# EAGLE design emergency (EAGLE 9.4.2)

## Sheet 1 of 3
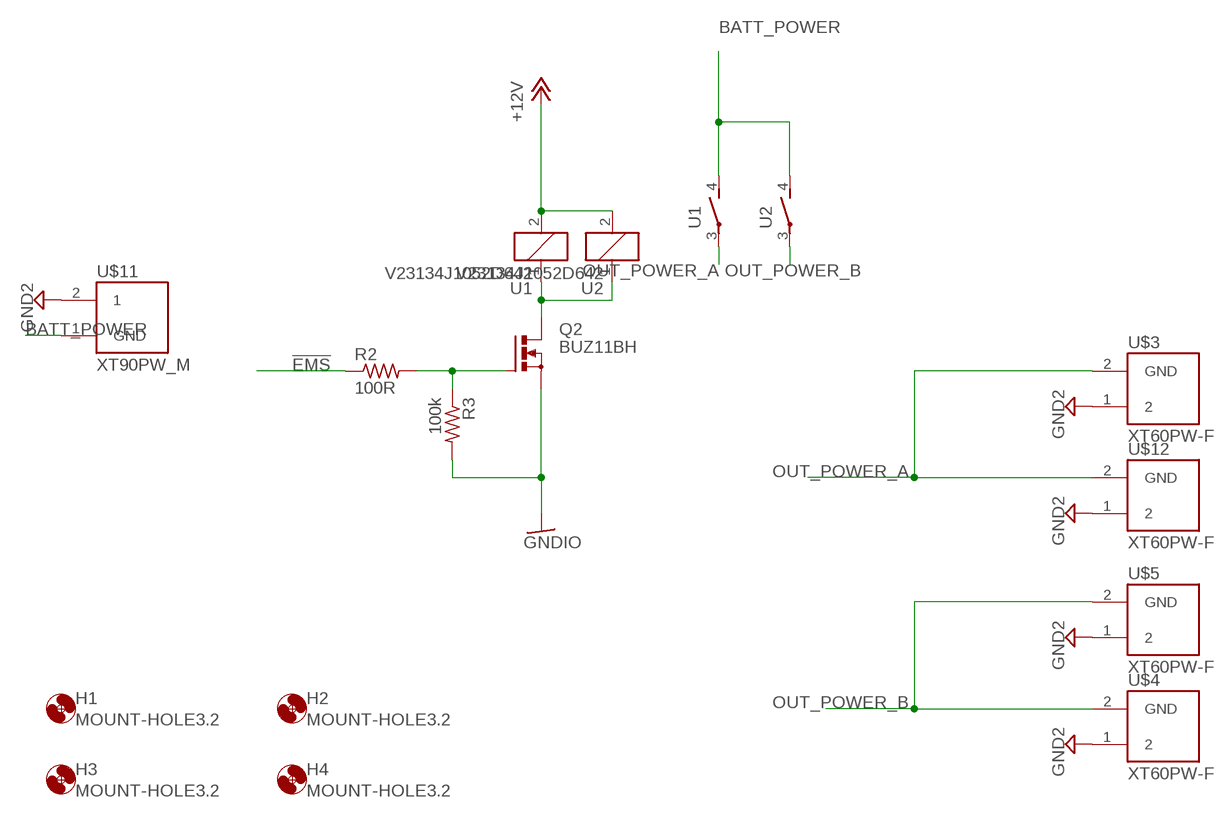
[diagram p0: schematic, sheet 1]

### Parts
H1  MOUNT-HOLE3.2  [3,2]
H2  MOUNT-HOLE3.2  [3,2]
H3  MOUNT-HOLE3.2  [3,2]
H4  MOUNT-HOLE3.2  [3,2]
Q2  BUZ11BH  [TO220BH]
R2  100R  R-US_R0603  [R0603]
R3  100k  R-US_R0603  [R0603]
U1  V23134J1052D642  [V23134J1052D642]
U2  V23134J1052D642  [V23134J1052D642]
U$3  XT60PW-F  [AMASS_XT60PW-F]
U$4  XT60PW-F  [AMASS_XT60PW-F]
U$5  XT60PW-F  [AMASS_XT60PW-F]
U$11  XT90PW_M  [AMASS_XT90PW_M]
U$12  XT60PW-F  [AMASS_XT60PW-F]

### Nets
!EMS: R2.1 ; also sheet 2
+12V: U1.2 U2.2 ; also sheet 2,3
BATT_POWER: U1.4(B:S) U2.4(B:S) U$11.1(GND)
GND2: U$3.1 U$4.1 U$5.1 U$11.2 U$12.1
GNDIO: Q2.S R3.2 ; also sheet 2,3
N$6: Q2.D U1.1 U2.1
N$7: Q2.G R2.2 R3.1
OUT_POWER_A: U1.3(B:P) U$3.2(GND) U$12.2(GND)
OUT_POWER_B: U2.3(B:P) U$4.2(GND) U$5.2(GND)

## Sheet 2 of 3
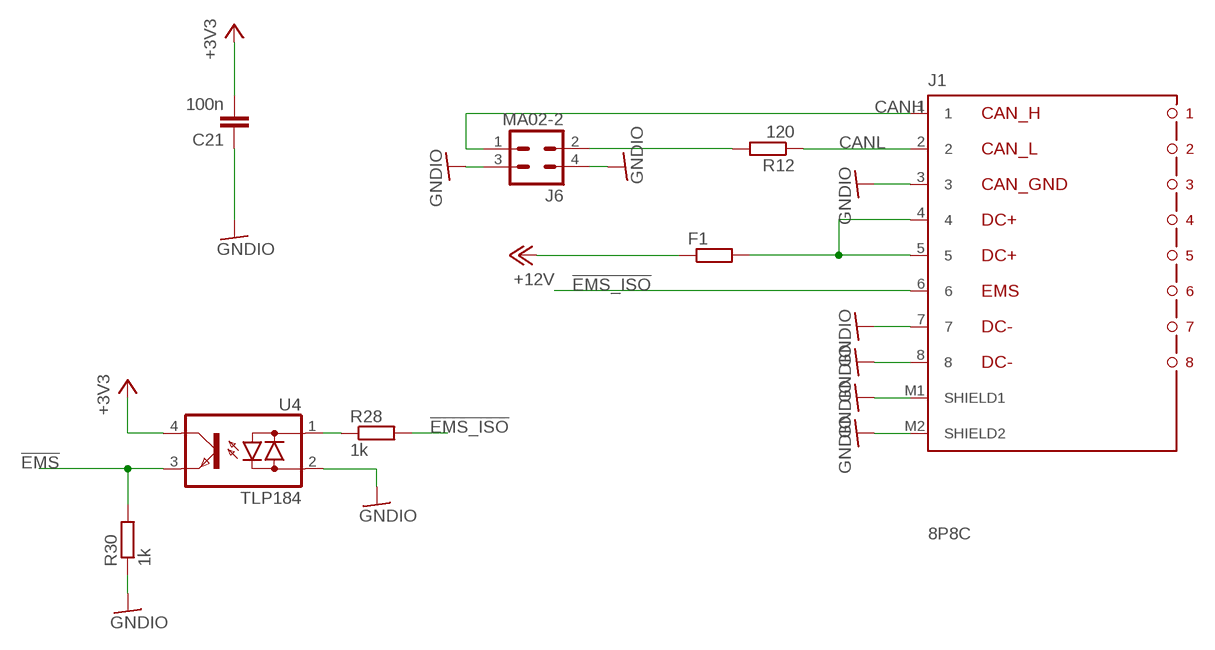
[diagram p1: schematic, sheet 2]

### Parts
C21  100n  C-EUC0603  [C0603]
F1  R-EU_R1206  [R1206]
J1  8P8C  [8P8C]
J6  MA02-2  [MA02-2W]
R12  120  R-EU_R0603  [R0603]
R28  1k  R-EU_R0603  [R0603]
R30  1k  R-EU_R0603  [R0603]
U4  TLP184  [11-4M1S]

### Nets
!EMS: R30.2 U4.3(E) ; also sheet 1
!EMS_ISO: J1.6 R28.2
+3V3: C21.2 U4.4(C) ; also sheet 3
+12V: F1.1 ; also sheet 1,3
CANH: J1.1 J6.1
CANL: J1.2 R12.1
GNDIO: C21.1 J1.3 J1.7 J1.8 J1.M1(SHIELD1) J1.M2(SHIELD2) J6.3 J6.4 R30.1 U4.2(AC2) ; also sheet 1,3
N$8: F1.2 J1.4 J1.5
N$9: J6.2 R12.2
N$30: R28.1 U4.1(AC1)

## Sheet 3 of 3
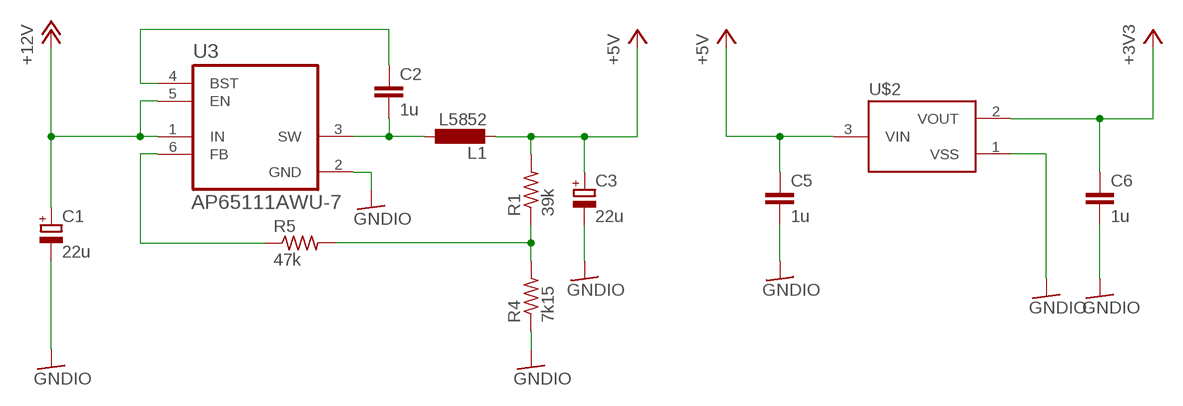
[diagram p2: schematic, sheet 3]

### Parts
C1  22u  CPOL-EUE2-5  [E2-5]
C2  1u  C-EUC0603  [C0603]
C3  22u  CPOL-EUE2-5  [E2-5]
C5  1u  C-EUC0603  [C0603]
C6  1u  C-EUC0603  [C0603]
L1  L5852  [L5852]
R1  39k  R-US_R0603  [R0603]
R4  7k15  R-US_R0603  [R0603]
R5  47k  R-US_R0603  [R0603]
U3  AP65111AWU-7  [SOT95P280X100-6N]
U$2  AP2120  [SOT95P240X110-3]

### Nets
+3V3: C6.1 U$2.2(VOUT) ; also sheet 2
+5V: C3.+ C5.1 L1.P$2 R1.2 U$2.3(VIN)
+12V: C1.+ U3.1(IN) U3.5(EN) ; also sheet 1,2
GNDIO: C1.- C3.- C5.2 C6.2 R4.1 U3.2(GND) U$2.1(VSS) ; also sheet 1,2
N$1: C2.2 L1.P$1 U3.3(SW)
N$2: C2.1 U3.4(BST)
N$3: R1.1 R4.2 R5.2
N$5: R5.1 U3.6(FB)

## Library data of the parts
C1 C3 = rcl:CPOL-EU: POLARIZED CAPACITOR, European symbol; SPICEPREFIX: C
C2 C5 C6 = rcl:C-EU: CAPACITOR, European symbol; SPICEPREFIX: C
C21 = rcl:C-EU: CAPACITOR, European symbol
F1 R12 R28 R30 = rcl:R-EU_: RESISTOR, European symbol; SPICEPREFIX: R
H1-H4 = holes:MOUNT-HOLE: MOUNTING HOLE with drill center marker
J1 = con-rj45:8P8C
J6 = con-headers:MA02-2
L1 = l_ysk:L5852
Q2 = transistor-power:BUZ11: N-CHANNEL MOS FET
R1-R5 = rcl:R-US_: RESISTOR, American symbol; SPICEPREFIX: R
U1 U2 = relay:V23134J1052D642
U3 = AP65111AWU-7:AP65111AWU-7: None; DESCRIPTION: Dcdc Conv Hv Buck Tsot26 t&r 3k; DIGI-KEY_PART_NUMBER: AP65111AWU-7DICT-ND; DIGI-KEY_PURCHASE_URL: https://www.digikey.jp/product-detail/en/diodes-incorporated/AP65111AWU-7/AP65111AWU-7DICT-ND/7652826?utm_source=snapeda&utm_medium=aggregator&utm_campaign=symbol; MF: Diodes Inc.; MP: AP65111AWU-7; PACKAGE: TSOT-23-6 Diodes Inc.
U4 = md201x:TLP184
U$2 = torex:AP2120
U$3-U$5 U$12 = XT60_Connecotr:XT60PW-F; AVAILABILITY: Unavailable; MF: AMASS; MP: XT60PW-M; PACKAGE: Package Analog Devices; PRICE: None
U$11 = XT60_Connecotr:XT90PW_M

## Board
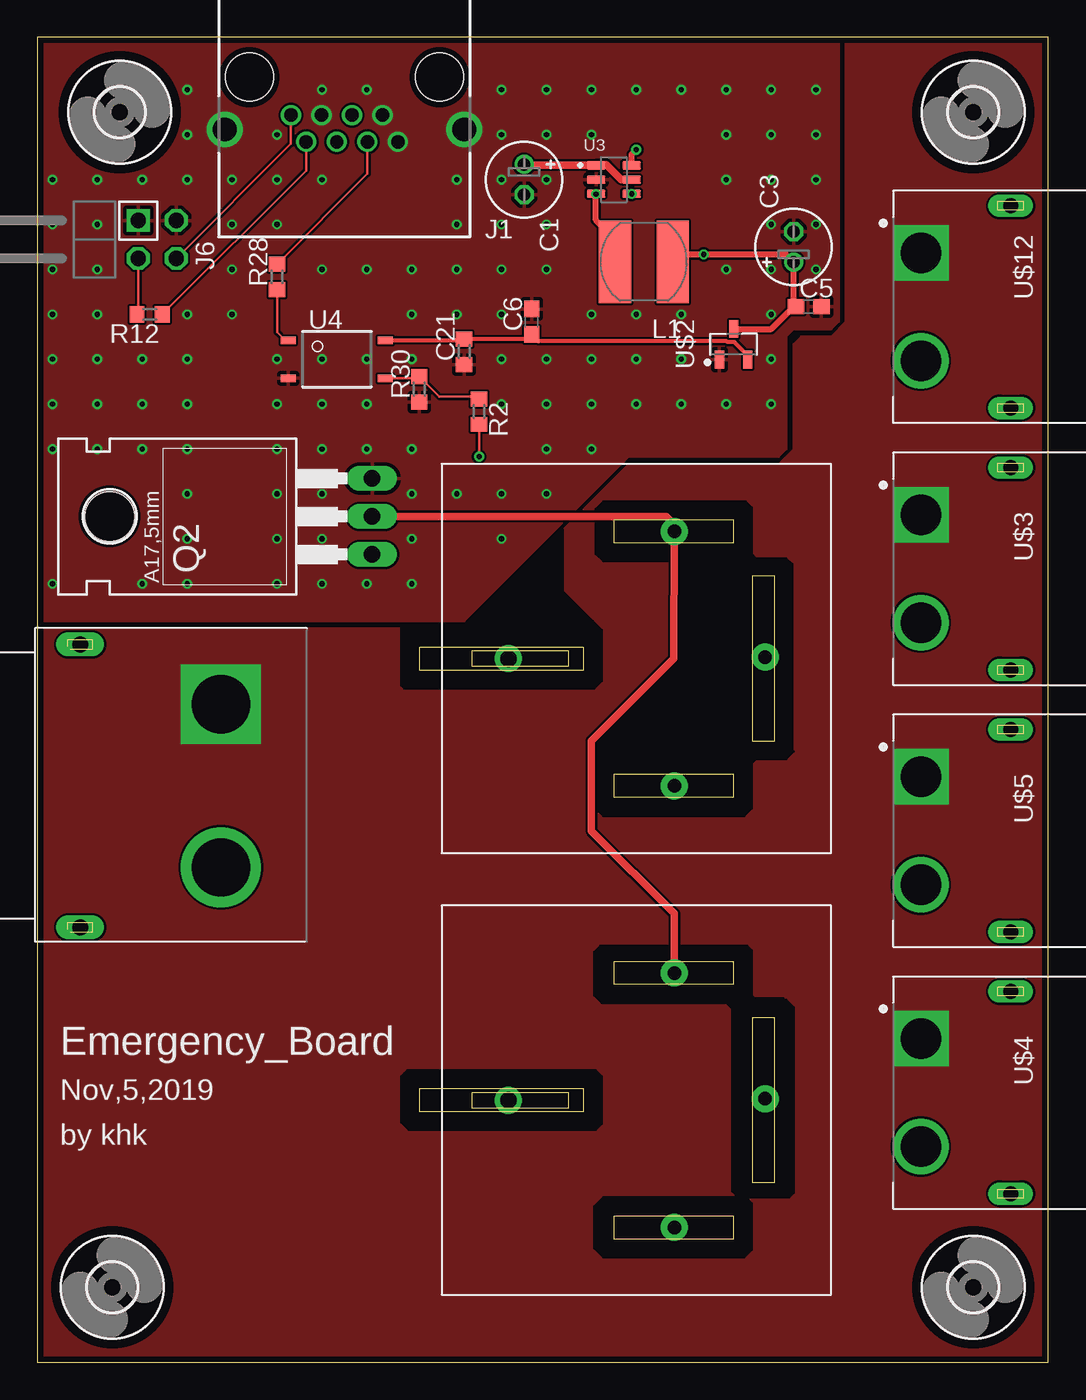
[diagram p3: board, top side]
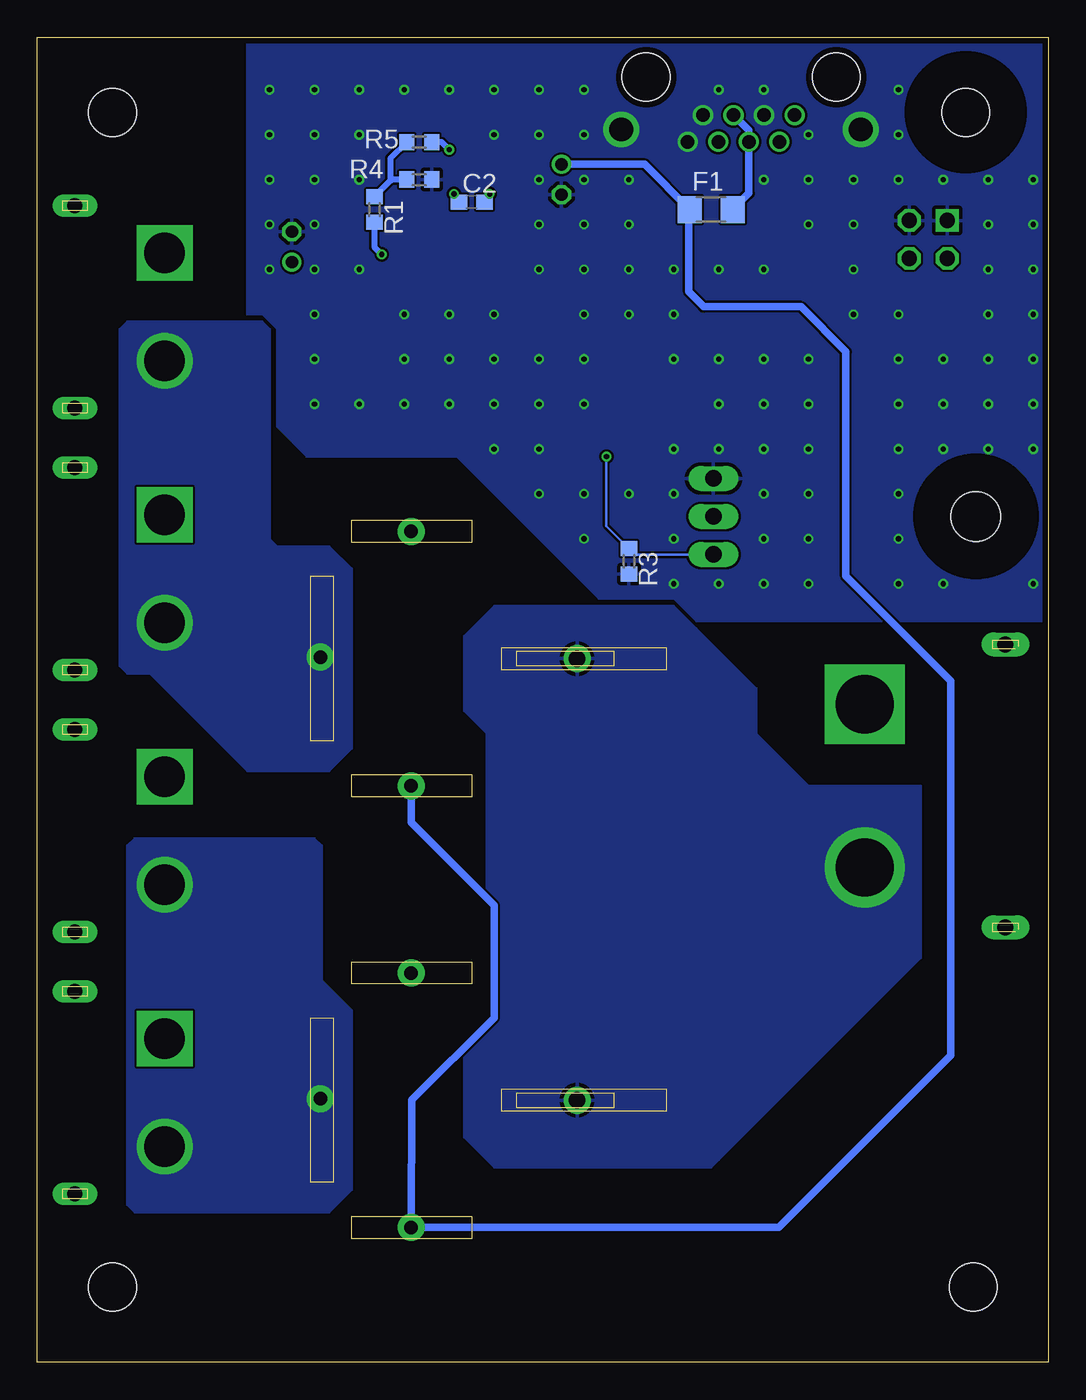
[diagram p4: board, bottom side, seen from below]

Size 67.5 x 88.5 mm. Coordinates in mm from the lower left corner, seen from the top.
Outline: 0,0 67.5,0 67.5,88.5 0,88.5 0,0
Copper layers (1*16): Top 0.035mm / dielectric 1.5mm / Bottom 0.035mm
Design rules "seeed_2layers": minimum track width 6mil, minimum drill 0.2mm, track to track 6mil, track to pad 6mil, pad to pad 6mil, via to via 6mil, smd to smd 0mil, copper to edge 0.4mm, drill to drill 12mil, minimum pad ring 0.15mm, minimum via ring 0.15mm, stop-mask expansion 4mil, vias tented up to drill 50mil, thermal gap 10mil

### Footprints (pad centres in the part's own frame; a part is rotated, then mirrored left to right if it is on the bottom)
E2-5 = drill 0.813 pad 1.27: + -1.016,0 | drill 0.813 pad 1.27 octagon: - 1.016,0
C0603 = smd 1.1 x 1: 1 -0.85,0; 2 0.85,0
C0603' = smd 1 x 1.1: 1 -0.85,0; 2 0.85,0
R1206 = smd 1.6 x 1.803: 1 -1.422,0; 2 1.422,0
3,2 = hole 3.2: 0,0
8P8C = drill 0.9 pad 1.3: 1 3.57,-3.81; 2 2.55,-2.03; 3 1.53,-3.81; 4 0.51,-2.03; 5 -0.51,-3.81; 6 -1.53,-2.03; 7 -2.55,-3.81; 8 -3.57,-2.03 | drill 1.6 pad 2.184: M1 -8,-2.85; M2 8,-2.85 | hole 3.2: 6.35,-6.35; -6.35,-6.35
MA02-2W = drill 1.016 octagon: 1 -1.27,-1.27; 2 -1.27,1.27; 3 1.27,-1.27 | drill 1.016 square: 4 1.27,1.27
L5852 = smd 2.15 x 5.5: P$1 1.925,0; P$2 -1.925,0
TO220BH = drill 1.118 long: D 0,-6.35; G -2.54,-6.35; S 2.54,-6.35 | hole 3.302: 0,11.176
R0603 = smd 1 x 1.1: 1 -0.85,0; 2 0.85,0
V23134J1052D642 = drill 0.9 pad 1.803: 1 -8.5,2.54; 2 8.5,2.54; 3 -0.1,8.6 | drill 1.092 pad 1.803: 4 0,-8.54
SOT95P280X100-6N = smd 1.24 x 0.55: 1 -1.185,0.95; 2 -1.185,0; 3 -1.185,-0.95; 4 1.185,-0.95; 5 1.185,0; 6 1.185,0.95
11-4M1S = smd 1 x 0.5: 1 -3.24,1.27; 2 -3.24,-1.27; 3 3.24,-1.27; 4 3.24,1.27
SOT95P240X110-3 = smd 1.18 x 0.609: 1 -1.024,0.95; 2 -1.024,-0.95; 3 1.024,0
AMASS_XT60PW-F = drill 2.7 square: 1 -3.6,-6 | drill 2.7: 2 3.6,-6 | drill 1 pad 1.2 long: S1 -6.75,0; S2 6.75,0
AMASS_XT90PW_M = drill 3.9 pad 5.334: 1 -5.45,-2.25 | drill 3.9 pad 5.334 square: 2 5.45,-2.25 | drill 1.067 pad 1.27 long: S1 -9.45,7.15 | drill 1.067 pad 1.2 long: S2 9.45,7.15

### Placement (x,y rotation side)
C1  32.5,79 270 top
C2  38.5,77.5 0 bottom
C3  50.5,74.5 90 top
C5  51.5,70.5 0 top
C6  33,69.5 90 top
C21  100n  [C0603']  28.5,67.5 90 top
F1  22.5,77 0 bottom
H1  5,5 0 top
H2  5.5,83.5 0 top
H3  62.5,83.5 0 top
H4  62.5,5 0 top
J1  20.5,79.5 180 top
J6  8,75 90 top
L1  40.5,73.5 180 top
Q2  16,56.5 90 top
R1  45,77 270 bottom
R2  29.5,63.5 270 top
R3  28,53.5 270 bottom
R4  42,79 180 bottom
R5  42,81.5 180 bottom
R12  7.5,70 180 top
R28  16,72.5 90 top
R30  25.5,65 90 top
U1  40,47 270 top
U2  40,17.5 270 top
U3  38.5,79 0 top
U4  20,67 0 top
U$2  46.5,68 90 top
U$3  65,53 270 top
U$4  65,18 270 top
U$5  65,35.5 270 top
U$11  10,38.5 90 top
U$12  65,70.5 270 top

### Tracks (layer width: path | path; a pad name or v marks a point on that pad's centre or on a via)
!EMS
  Top 0.152: U4.3 25.38,65.73 R30.2 26.85,64.5 29.35,64.5 R2.1
!EMS_ISO
  Top 0.152: J1.6 22.03,79.38 R28.2
+3V3
  Top 0.254: U$2.2 47.45,67.25 46.55,68.16 46.08,68.16 46.03,68.2 33.45,68.2 C6.1 32.7,68.35 C21.2 28.42,68.27 U4.4
+5V  (via drill 0.35)
  Top 0.406: L1.P$2 42.92,74 v44.5,74 49.98,74 C3.+ 50.5,70.65 50.58,70.58 | C5.1 50.58,70.58 | U$2.3 49.02,69.03 50.58,70.58
  Bottom 0.406: R1.2 45,74.5 v44.5,74
+12V
  Top 0.508: C1.+ 32.57,79.95 U3.1 37.37,80 38,80 39,79 U3.5
  Bottom 0.508: C1.+ 26.94,80.02 F1.1 24,76.92 24,71.5 23,70.5 16.5,70.5 13.5,67.5 13.5,52.5 6.5,45.5 6.5,20.5 18,9 U2.2 42.49,17.5 37,23 37,30.5 42.54,36.04 U1.2
BATT_POWER
  pour Bottom: 8.5,37 8.5,27 22,13.5 22.5,13 37,13 39,15 39,18.5 39,20.5 37.5,22 37.5,42 39,43.5 39,48.5 37,50.5 36,50.5 25,50.5 23.5,49 19.5,45 19.5,42 16,38.5 12.5,38.5 8.5,38.5
CANH
  Top 0.152: J1.1 16.93,81.39 J6.1
CANL
  Top 0.152: J1.2 17.95,79.6 R12.1
GND2
  pour Top: 0,49 0,0 67.5,0 67.5,88.5 54,88.5 54,69.5 53,68.5 51,68.5 50.5,68 50.5,61 49.5,60 39.5,60 28.5,49
  cutout Top: 24.3,49 24.3,45.2 24.5,45 37.2,45 37.7,45.5 37.7,45.7 37.7,48.9 37.1,49.5 35.1,51.5 35.1,55.6 28.5,49
  cutout Top: 24.5,19.3 24.3,19.1 24.3,16 24.8,15.5 37.3,15.5 37.7,15.9 37.7,16.1 37.7,18.8 37.7,19.1 37.3,19.5 24.7,19.5
  cutout Top: 47.3,11 37.8,11 37.2,10.4 37.2,7.6 37.8,7 47.2,7 47.7,7.5 47.7,10.6
  cutout Top: 46.4,23.6 46.4,11.4 46.8,11 50.2,11 50.5,11.3 50.5,23.7 50,24.2 49.9,24.2 49.8,24.3 47.9,24.3 47.7,24.5 47.7,27.5 47.4,27.8 37.6,27.8 37.2,27.4 37.2,24.5 37.7,24 46,24
  cutout Top: 37.9,40.5 37.8,40.5 37.3,40 37.3,37.3 37.3,37 37.8,36.5 47.2,36.5 47.7,37 47.7,37.1 47.7,39.6 47.7,40 48,40.3 50,40.3 50.5,40.8 50.4,40.9 50.4,53.2 50.4,53.3 50,53.7 48,53.7 47.8,53.9 47.7,54 47.7,57 47.7,57.1 47.3,57.5 37.8,57.5 37.3,57 37.3,54 37.8,53.5 46,53.5 46.5,53 46.5,41 46.5,40.7 46.3,40.5
GNDIO  (via drill 0.35)
  other vias: 1,79 1,76 4,76 1,73 4,73 4,70 1,70 1,67 4,67 7,67 7,64 4,64 1,64 1,61 7,61 4,61 1,52 7,52 10,52 10,55 10,58 10,61 10,64 10,67 10,70 13,70 13,73 13,76 13,79 10,79 10,82 10,85 16,82 19,85 22,85 19,79 16,79 16,76 19,73 22,73 16,67 22,67 19,67 16,64 19,64 16,61 19,61 16,58 19,58 16,55 19,55 19,52 16,52 22,52 25,52 25,55 31,55 31,58 28,58 25,58 25,61 22,61 22,64 34,58 34,61 37,61 37,64 34,64 34,67 31,67 31,64 25,67 25,70 25,73 28,73 28,70 31,70 31,73 34,73 37,70 37,67 28,76 28,79 31,85 31,82 31,79 31,76 34,76 34,79 34,82 34,85 37,85 40,85 37,82 40,70 40,67 40,64 43,64 43,67 43,70 46,73 49,73 49,70 49,67 49,64 46,64 49,76 49,79 46,79 46,82 46,85 43,85 49,85 52,85 52,82 49,82 52,79 52,76 52,73 4,79 7,79
  pour Top: 0,88.5 0,49.5 28.5,49.5 39.5,60.5 49.5,60.5 50,61 50,68.5 50.5,69 53,69 53.5,69.5 53.5,88.5
  pour Bottom: 0,88.5 0,49.5 23.5,49.5 25,51 30,51 39.5,60.5 49.5,60.5 51.5,62.5 51.5,69 52.5,70 53.5,70 53.5,88.5
N$1  (via drill 0.35)
  Top 0.406: L1.P$1 38.58,75.03 37.3,76.3 v37.3,78.03 U3.3
  Bottom 0.254: C2.2 37.3,77.85 v37.3,78.03
N$2  (via drill 0.35)
  Bottom 0.254: C2.1 39.69,77.83 U3.4
  other vias: 39.69,78.05
N$3
  Bottom 0.406: R4.2 43.85,79 43.92,78.92 | 43.92,78.92 R1.1 | R5.2 43.92,80.42 43.92,78.92
N$5  (via drill 0.35)
  Top 0.406: U3.6 39.69,80.69 v40,81
  Bottom 0.406: v40,81 40.5,81.5 R5.1
N$6
  Top 0.508: Q2.D 42,56.5 42.54,55.96 U1.1 42.5,47 38,42.5 37,41.5 37,35.5 42.54,29.96 U2.1
N$7  (via drill 0.35)
  Top 0.152: v29.5,60.5 R2.2
  Bottom 0.152: Q2.G 27.61,53.96 R3.1 29.5,55.85 v29.5,60.5
N$8
  Bottom 0.508: F1.2 19.99,78.09 J1.4 19.99,82.29 J1.5
N$9
  Top 0.152: J6.2 6.73,70.08 R12.2
N$30
  Top 0.152: U4.1 16.53,68.27 16,68.8 R28.1
OUT_POWER_A
  pour Bottom: 46.5,41 48,39.5 53.5,39.5 60,46 61.5,46 62,46.5 62,69 61.5,69.5 52.5,69.5 52,69 52,55 51.5,54.5 48,54.5 46.5,53
OUT_POWER_B
  pour Bottom: 46.5,23.5 48.5,25.5 48.5,34.5 49,35 61,35 61.5,34.5 61.5,10.5 61,10 48,10 46.5,11.5

### Text on the board
tNames: Emergency_Board | Nov,5,2019 | by khk